# Altium schematic sheet Sheet1.SchDoc
size A4
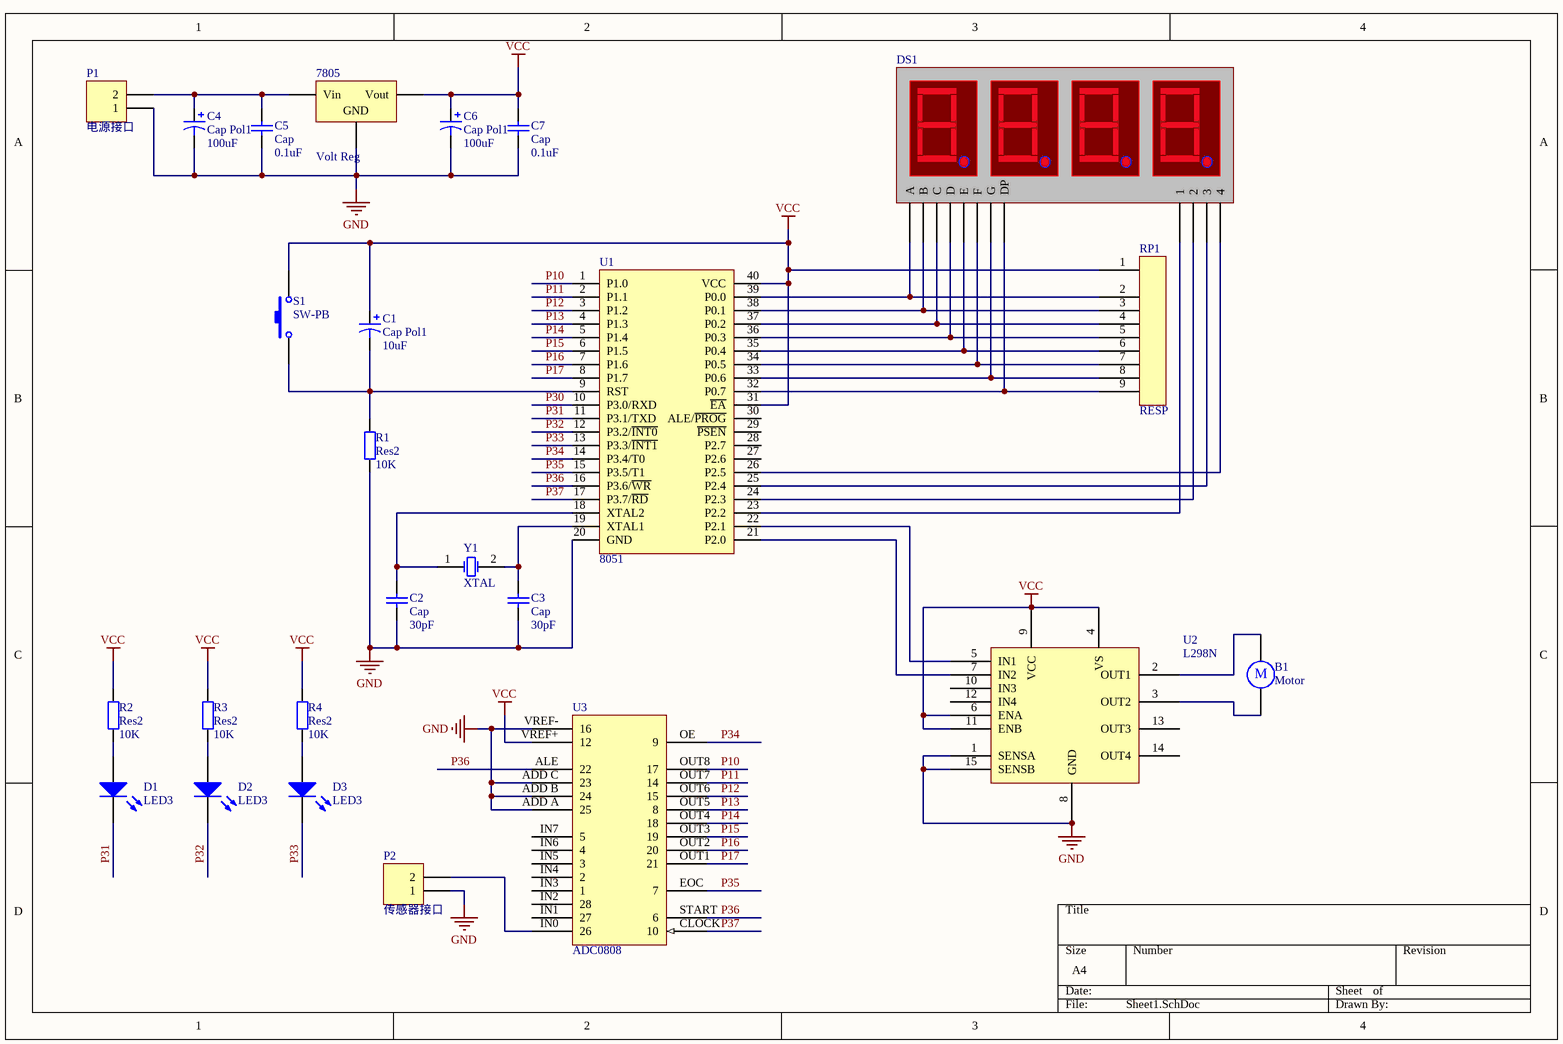
[diagram p0: Sheet1.SchDoc]

## Parts
7805  Volt Reg  [D2PAK_N]
B1  Motor  [RB5-10.5]
C1  Cap Pol1  value 10uF  [RB7.6-15]
C2  Cap  value 30pF  [RAD-0.3]
C3  Cap  value 30pF  [RAD-0.3]
C4  Cap Pol1  value 100uF  [RB7.6-15]
C5  Cap  value 0.1uF  [RAD-0.3]
C6  Cap Pol1  value 100uF  [RB7.6-15]
C7  Cap  value 0.1uF  [RAD-0.3]
D1  LED3  [3.5X2.8X1.9]
D2  LED3  [3.5X2.8X1.9]
D3  LED3  [3.5X2.8X1.9]
DS1  (no value)
P1  电源接口  [HDR1X2]
P2  传感器接口  [HDR1X2]
R1  Res2  value 10K  [AXIAL-0.4]
R2  Res2  value 10K  [AXIAL-0.4]
R3  Res2  value 10K  [AXIAL-0.4]
R4  Res2  value 10K  [AXIAL-0.4]
RP1  RESP
S1  SW-PB  [SPST-2]
U1  8051
U2  L298N
U3  ADC0808
Y1  XTAL  [R38]

## Nets
GND: 7805.2(GND) C2.1 C3.1 C4.2 C5.1 C6.2 C7.1 P1.1 P2.1 R1.1 U1.20(GND) U2.1(SENSA) U2.8(GND) U2.15(SENSB) U3.ADD_A(25) U3.ADD_B(24) U3.ADD_C(23) U3.VREF-(16)
VCC: 7805.3(Vout) C1.1 C6.1 C7.2 R2.2 R3.2 R4.2 RP1.1 S1.2 U1.31(~{EA}) U1.40(VCC) U2.4(VS) U2.6(ENA) U2.9(VCC) U2.11(ENB) U3.VREF+(12)
P10: U1.1(P1.0) U3.OUT8(17)
P11: U1.2(P1.1) U3.OUT7(14)
P12: U1.3(P1.2) U3.OUT6(15)
P13: U1.4(P1.3) U3.OUT5(8)
P14: U1.5(P1.4) U3.OUT4(18)
P15: U1.6(P1.5) U3.OUT3(19)
P16: U1.7(P1.6) U3.OUT2(20)
P17: U1.8(P1.7) U3.OUT1(21)
P30: U1.10(P3.0/RXD)
P31: D1.2(K) U1.11(P3.1/TXD)
P32: D2.2(K) U1.12(P3.2/~{INT0})
P33: D3.2(K) U1.13(P3.3/~{INT1})
P34: U1.14(P3.4/T0) U3.OE(9)
P35: U1.15(P3.5/T1) U3.EOC(7)
P36: U1.16(P3.6/~{WR}) U3.ALE(22) U3.START(6)
P37: U1.17(P3.7/~{RD}) U3.CLOCK(10)
Net7805_1: 7805.1(Vin) C4.1 C5.2 P1.2
NetB1_1: B1.1 U2.2(OUT1)
NetB1_2: B1.2 U2.3(OUT2)
NetC1_2: C1.2 R1.2 S1.1 U1.9(RST)
NetC2_2: C2.2 U1.18(XTAL2) Y1.1(OSC1)
NetC3_2: C3.2 U1.19(XTAL1) Y1.2(OSC2)
NetD1_1: D1.1(A) R2.1
NetD2_1: D2.1(A) R3.1
NetD3_1: D3.1(A) R4.1
NetDS1_?1: DS1.?1(A) RP1.2 U1.39(P0.0)
NetDS1_?2: DS1.?2(B) RP1.3 U1.38(P0.1)
NetDS1_?3: DS1.?3(C) RP1.4 U1.37(P0.2)
NetDS1_?4: DS1.?4(D) RP1.5 U1.36(P0.3)
NetDS1_?5: DS1.?5(E) RP1.6 U1.35(P0.4)
NetDS1_?6: DS1.?6(F) RP1.7 U1.34(P0.5)
NetDS1_?7: DS1.?7(G) RP1.8 U1.33(P0.6)
NetDS1_?8: DS1.?8(DP) RP1.9 U1.32(P0.7)
NetDS1_?9: DS1.?9(1) U1.23(P2.2)
NetDS1_?10: DS1.?10(2) U1.24(P2.3)
NetDS1_?11: DS1.?11(3) U1.25(P2.4)
NetDS1_?12: DS1.?12(4) U1.26(P2.5)
NetP2_2: P2.2 U3.IN0(26)
NetU1_21: U1.21(P2.0) U2.7(IN2)
NetU1_22: U1.22(P2.1) U2.5(IN1)

Not connected (* = marked no-connect by the designer): U1 27(P2.6) 28(P2.7) 29(~{PSEN}) 30(ALE/~{PROG}); U2 10(IN3) 12(IN4) 13(OUT3) 14(OUT4); U3 IN1(27) IN2(28) IN3(1) IN4(2) IN5(3) IN6(4) IN7(5)

## Notes on the sheet
- (in symbol Motor) M

## Library data of the parts
7805 = Volt Reg: Voltage Regulator; Published: 24-Mar-1999; LatestRevisionDate: 29-May-2009; LatestRevisionNote: IPC-7351 Footprint Added.; PackageReference: D2PAK; Publisher: Altium Limited; PackageDescription: 3-Pin Transistor Outline Package 2.54 mm Pitch, 15.1 mm Lead Span
B1 = Motor: Motor, General Kind; Published: 24-Mar-1999; LatestRevisionDate: 17-Jul-2002; LatestRevisionNote: Re-released for DXP Platform.; PackageReference: RB5-10.5; Publisher: Altium Limited; PackageDescription: Capacitor (Radial); 2 Leads
C1 C4 C6 = Cap Pol1: Polarized Capacitor (Radial); Published: 8-Jun-2000; LatestRevisionDate: 17-Jul-2002; LatestRevisionNote: Re-released for DXP Platform.; PackageReference: RB7.6-15; Publisher: Altium Limited; PackageDescription: Polarized Capacitor (Radial); 2 Leads
C2 C3 C5 C7 = Cap: Capacitor; Published: 8-Jun-2000; LatestRevisionDate: 17-Jul-2002; LatestRevisionNote: Re-released for DXP Platform.; PackageReference: RAD-0.3; Publisher: Altium Limited; PackageDescription: Radial Cap, Thru-Hole; 2 Leads; 0.3 in Pin Spacing
D1-D3 = LED3: Typical BLUE SiC LED; Published: 8-Jun-2000; LatestRevisionDate: 17-Dec-2003; LatestRevisionNote: PCB Footprint replaced.; DatasheetVersion: 16-Apr-2002; PackageVersion: 16-Apr-2002; PackageReference: 3.5X2.8X1.9; Publisher: Altium Limited; PackageDescription: SM LED; 2 C-Bend Leads; Body 3.5 x 2.8 x 1.9 mm, inc leads (LxWxH typ)
DS1 = 数码管4
P1 P2 = Header 2: Header, 2-Pin; LatestRevisionDate: 17-Jul-2002; LatestRevisionNote: Re-released for DXP Platform.; Publisher: Altium Limited
R1-R4 = Res2: Resistor; Published: 8-Jun-2000; LatestRevisionDate: 17-Jul-2002; LatestRevisionNote: Re-released for DXP Platform.; PackageReference: AXIAL-0.4; Publisher: Altium Limited; PackageDescription: Axial Device, Thru-Hole; 2 Leads; 0.4 in Pin Spacing
S1 = SW-PB: Switch; Published: 24-Mar-1999; LatestRevisionDate: 17-Jul-2002; LatestRevisionNote: Re-released for DXP Platform.; PackageReference: SPST-2; Publisher: Altium Limited; PackageDescription: Switch; 2 Leads
U3 = ADC0809
Y1 = XTAL: Crystal Oscillator; Published: 8-Jun-2000; LatestRevisionDate: 17-Jul-2002; LatestRevisionNote: Re-released for DXP Platform.; PackageReference: R38; Publisher: Altium Limited; PackageDescription: Crystal, Thru-Hole; 2 Leads; Body 3.1 x 8.2 mm (Dia.xH)